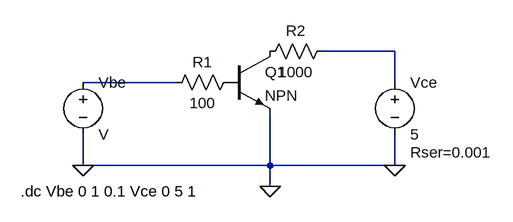
[diagram p0: schematic BJT.asc]
BJT.asc, the LTspice schematic file:
Version 4
SHEET 1 880 680
WIRE 400 96 288 96
WIRE 64 144 -80 144
WIRE 400 144 400 96
WIRE -80 272 -80 224
WIRE 208 272 208 192
WIRE 208 272 -80 272
WIRE 400 272 400 224
WIRE 400 272 208 272
WIRE 208 304 208 272
FLAG 208 304 0
FLAG 400 272 0
FLAG -80 272 0
SYMBOL npn 144 96 R0
SYMATTR InstName Q1
SYMBOL voltage -80 128 R0
SYMATTR InstName Vbe
SYMBOL voltage 400 128 R0
WINDOW 123 0 0 Left 0
WINDOW 39 24 124 Left 2
SYMATTR InstName Vce
SYMATTR Value 5
SYMATTR SpiceLine Rser=0.001
SYMBOL res 160 128 R90
WINDOW 0 0 56 VBottom 2
WINDOW 3 32 56 VTop 2
SYMATTR InstName R1
SYMATTR Value 100
SYMBOL res 304 80 R90
WINDOW 0 0 56 VBottom 2
WINDOW 3 32 56 VTop 2
SYMATTR InstName R2
SYMATTR Value 1000
TEXT -176 312 Left 2 !.dc Vbe 0 1 0.1 Vce 0 5 1

The netlist it stands for:
* BJT.asc
Q1 P001 P002 0 0 NPN
Vbe N002 0 V
Vce N001 0 5 Rser=0.001
R1 P002 N002 100
R2 N001 P001 1000
.model NPN NPN
.model PNP PNP
.lib standard.bjt
.dc Vbe 0 1 0.1 Vce 0 5 1
.backanno
.end